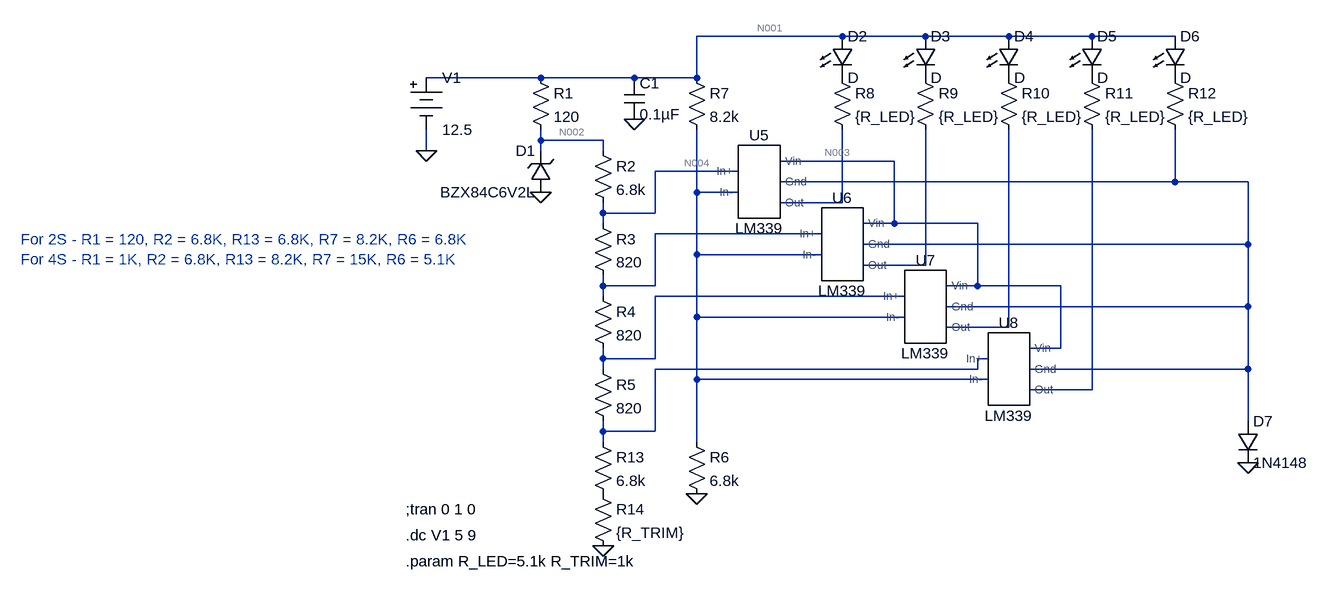
[diagram p0: schematic 4S Battery Meter.asc]
4S Battery Meter.asc, the LTspice schematic file:
Version 4
SHEET 1 1480 936
WIRE 752 80 528 80
WIRE 880 80 752 80
WIRE 1008 80 880 80
WIRE 1136 80 1008 80
WIRE 1264 80 1136 80
WIRE 288 144 112 144
WIRE 432 144 288 144
WIRE 528 144 528 80
WIRE 528 144 432 144
WIRE 288 240 288 224
WIRE 384 240 288 240
WIRE 112 256 112 224
WIRE 288 256 288 240
WIRE 384 256 384 240
WIRE 832 272 656 272
WIRE 592 288 464 288
WIRE 1264 304 1264 224
WIRE 1264 304 656 304
WIRE 1376 304 1264 304
WIRE 528 320 528 224
WIRE 592 320 528 320
WIRE 752 336 752 224
WIRE 752 336 656 336
WIRE 384 352 384 336
WIRE 464 352 464 288
WIRE 464 352 384 352
WIRE 384 368 384 352
WIRE 832 368 832 272
WIRE 832 368 784 368
WIRE 960 368 832 368
WIRE 720 384 464 384
WIRE 1376 400 1376 304
WIRE 1376 400 784 400
WIRE 528 416 528 320
WIRE 720 416 528 416
WIRE 880 432 880 224
WIRE 880 432 784 432
WIRE 384 464 384 448
WIRE 464 464 464 384
WIRE 464 464 384 464
WIRE 960 464 960 368
WIRE 960 464 912 464
WIRE 1088 464 960 464
WIRE 384 480 384 464
WIRE 848 480 464 480
WIRE 1376 496 1376 400
WIRE 1376 496 912 496
WIRE 528 512 528 416
WIRE 848 512 528 512
WIRE 1008 528 1008 224
WIRE 1008 528 912 528
WIRE 1088 560 1088 464
WIRE 1088 560 1040 560
WIRE 384 576 384 560
WIRE 464 576 464 480
WIRE 464 576 384 576
WIRE 976 576 960 576
WIRE 384 592 384 576
WIRE 960 592 960 576
WIRE 960 592 464 592
WIRE 1376 592 1376 496
WIRE 1376 592 1040 592
WIRE 528 608 528 512
WIRE 976 608 528 608
WIRE 1136 624 1136 224
WIRE 1136 624 1040 624
WIRE 1376 672 1376 592
WIRE 384 688 384 672
WIRE 464 688 464 592
WIRE 464 688 384 688
WIRE 384 704 384 688
WIRE 528 704 528 608
FLAG 112 256 0
FLAG 288 320 0
FLAG 384 864 0
FLAG 528 784 0
FLAG 1376 736 0
FLAG 432 208 0
SYMBOL Misc\\battery 112 128 R0
WINDOW 123 0 0 Left 0
WINDOW 39 0 0 Left 0
SYMATTR InstName V1
SYMATTR Value 12.5
SYMBOL res 272 128 R0
SYMATTR InstName R1
SYMATTR Value 120
SYMBOL zener 304 320 R180
WINDOW 0 24 64 Left 2
WINDOW 3 24 0 Left 2
SYMATTR InstName D1
SYMATTR Value BZX84C6V2L
SYMBOL res 368 240 R0
SYMATTR InstName R2
SYMATTR Value 6.8k
SYMBOL res 368 352 R0
SYMATTR InstName R3
SYMATTR Value 820
SYMBOL res 368 464 R0
SYMATTR InstName R4
SYMATTR Value 820
SYMBOL res 368 576 R0
SYMATTR InstName R5
SYMATTR Value 820
SYMBOL res 512 688 R0
SYMATTR InstName R6
SYMATTR Value 6.8k
SYMBOL res 512 128 R0
SYMATTR InstName R7
SYMATTR Value 8.2k
SYMBOL res 736 128 R0
SYMATTR InstName R8
SYMATTR Value {R_LED}
SYMBOL res 864 128 R0
SYMATTR InstName R9
SYMATTR Value {R_LED}
SYMBOL res 992 128 R0
SYMATTR InstName R10
SYMATTR Value {R_LED}
SYMBOL res 1120 128 R0
SYMATTR InstName R11
SYMATTR Value {R_LED}
SYMBOL LED 736 80 R0
SYMATTR InstName D2
SYMBOL LED 864 80 R0
SYMATTR InstName D3
SYMBOL LED 992 80 R0
SYMATTR InstName D4
SYMBOL LED 1120 80 R0
SYMATTR InstName D5
SYMBOL LED 1248 80 R0
SYMATTR InstName D6
SYMBOL res 1248 128 R0
SYMATTR InstName R12
SYMATTR Value {R_LED}
SYMBOL res 368 688 R0
SYMATTR InstName R13
SYMATTR Value 6.8k
SYMBOL diode 1360 672 R0
SYMATTR InstName D7
SYMATTR Value 1N4148
SYMBOL cap 416 144 R0
SYMATTR InstName C1
SYMATTR Value 0.1µF
SYMBOL res 368 768 R0
SYMATTR InstName R14
SYMATTR Value {R_TRIM}
SYMBOL LM339 624 304 R0
SYMATTR InstName U5
SYMBOL LM339 752 400 R0
SYMATTR InstName U6
SYMBOL LM339 880 496 R0
SYMATTR InstName U7
SYMBOL LM339 1008 592 R0
SYMATTR InstName U8
TEXT 80 808 Left 2 !;tran 0 1 0
TEXT 80 848 Left 2 !.dc V1 5 9
TEXT 80 888 Left 2 !.param R_LED=5.1k R_TRIM=1k
TEXT -512 392 Left 2 ;For 2S - R1 = 120, R2 = 6.8K, R13 = 6.8K, R7 = 8.2K, R6 = 6.8K\nFor 4S - R1 = 1K, R2 = 6.8K, R13 = 8.2K, R7 = 15K, R6 = 5.1K

The netlist it stands for:
* 4S Battery Meter.asc
V1 N001 0 12.5
R1 N001 N002 120
D1 0 N002 BZX84C6V2L
R2 N002 N004 6.8k
R3 N004 N008 820
R4 N008 N010 820
R5 N010 N012 820
R6 N006 0 6.8k
R7 N001 N006 8.2k
R8 P001 N007 {R_LED}
R9 P002 N009 {R_LED}
R10 P003 N011 {R_LED}
R11 P004 N013 {R_LED}
D2 N001 P001 D
D3 N001 P002 D
D4 N001 P003 D
D5 N001 P004 D
D6 N001 P005 D
R12 P005 N005 {R_LED}
R13 N012 P006 6.8k
D7 N005 0 1N4148
C1 N001 0 0.1µF
R14 P006 0 {R_TRIM}
XU5 N004 N006 N003 N005 N007 LM339  ; pins In+ In- Vin Gnd Out
XU6 N008 N006 N003 N005 N009 LM339  ; pins In+ In- Vin Gnd Out
XU7 N010 N006 N003 N005 N011 LM339  ; pins In+ In- Vin Gnd Out
XU8 N012 N006 N003 N005 N013 LM339  ; pins In+ In- Vin Gnd Out
.model D D
.lib standard.dio
;tran 0 1 0
.dc V1 5 9
.param R_LED=5.1k R_TRIM=1k
* For 2S - R1 = 120, R2 = 6.8K, R13 = 6.8K, R7 = 8.2K, R6 = 6.8K
* For 4S - R1 = 1K, R2 = 6.8K, R13 = 8.2K, R7 = 15K, R6 = 5.1K
.lib C:\Users\bapel\Documents\GitHub\High-Current-5V-Regulator\LM339.sub
.backanno
.end

* Results of the author's LTspice run, read from the files saved beside the schematic
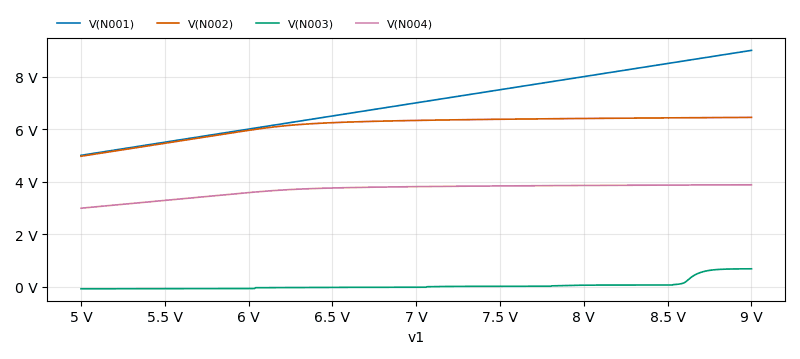
[diagram p1: DC transfer characteristic of 4S Battery Meter.asc, plotted from the saved traces]
* DC transfer characteristic, 1 run:
*   V(N001): 5 V at v1=5 V, 9 V at v1=9 V, min 5 V, max 9 V
*   V(N002): 4.965 V at v1=5 V, 6.446 V at v1=9 V, min 4.965 V, max 6.446 V
*   V(N003): -85.91 mV at v1=5 V, 676.2 mV at v1=9 V, min -85.91 mV, max 676.2 mV
*   V(N004): 2.986 V at v1=5 V, 3.878 V at v1=9 V, min 2.986 V, max 3.878 V